# Altium schematic sheet usb.SchDoc
size 420 x 297 mm
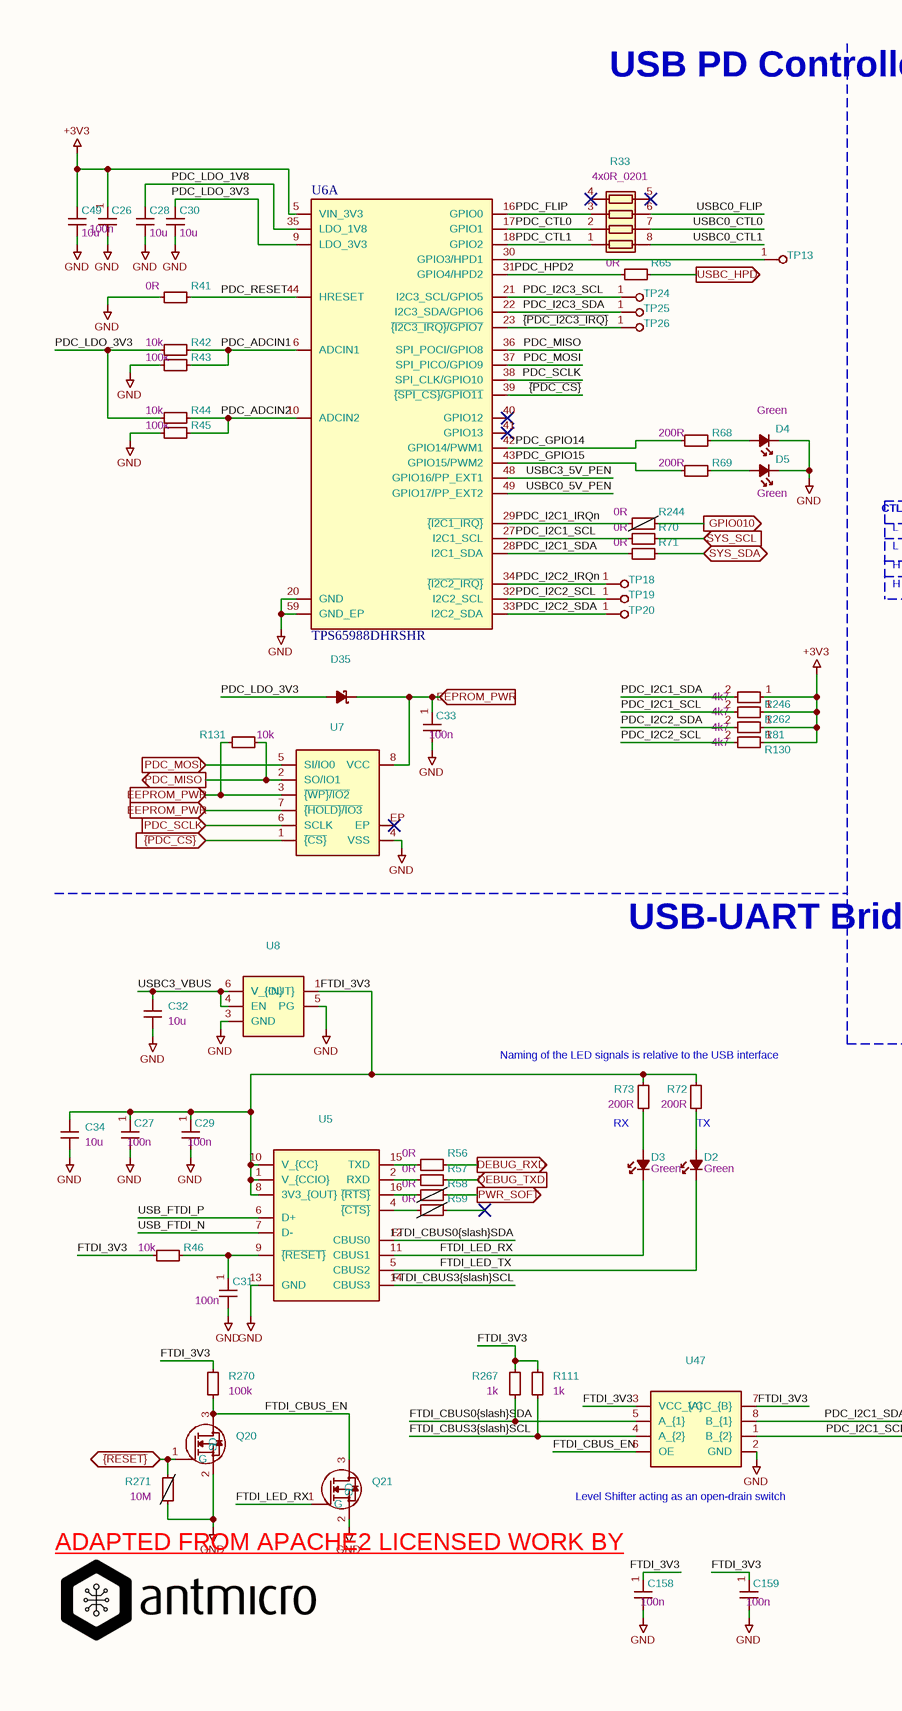
[diagram p0: usb.SchDoc, left]
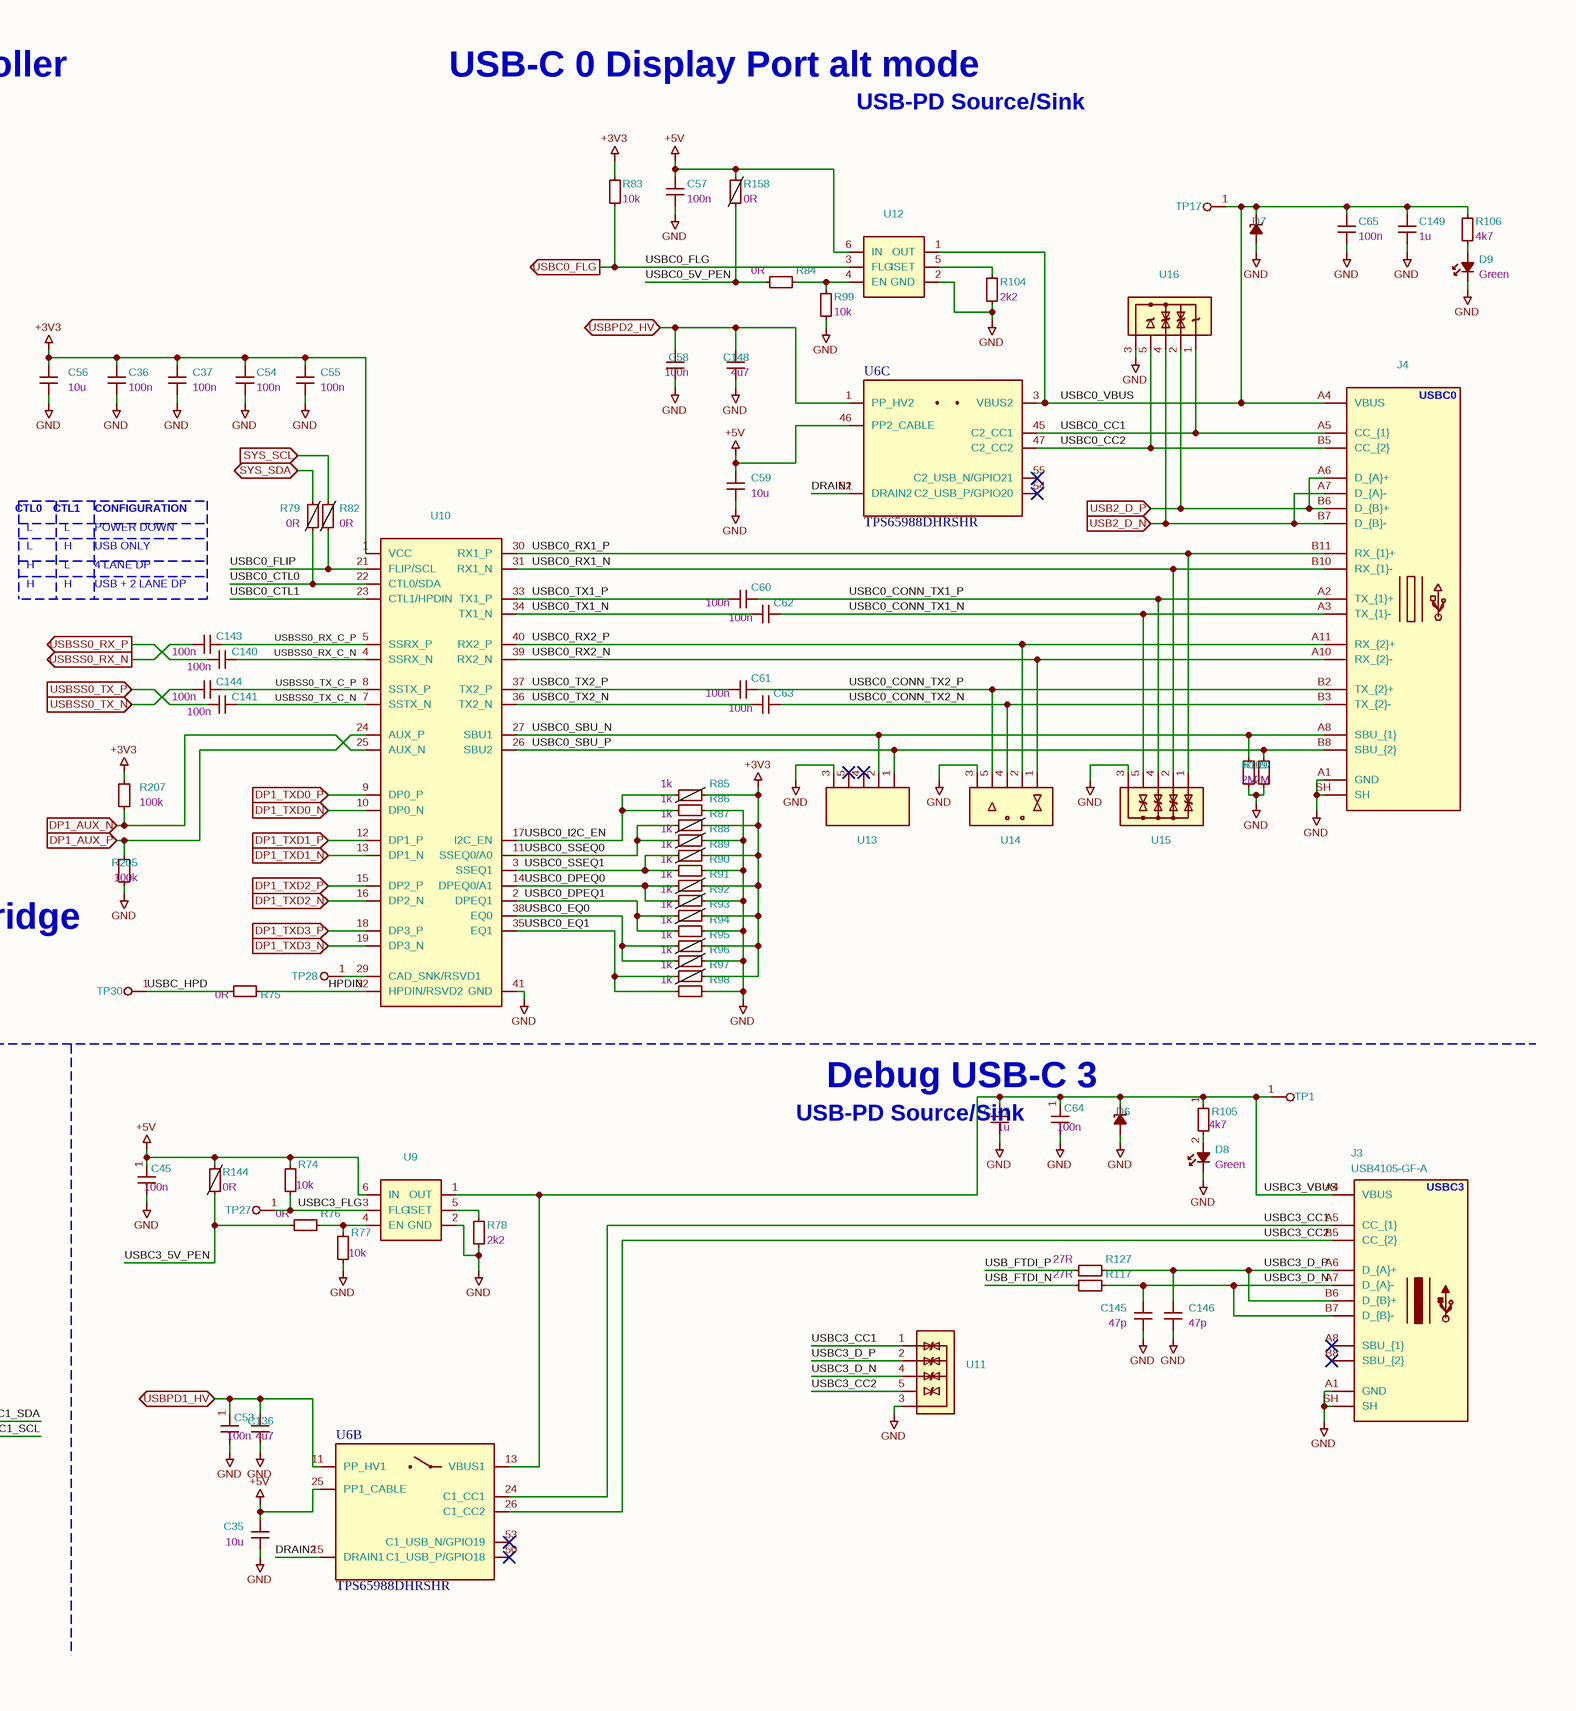
[diagram p1: usb.SchDoc, right]

## Parts
C26  Val: 100n  [C_0402_1005Metric]  (hidden comment: GRM155R61H104KE14D)
C27  Val: 100n  [C_0402_1005Metric]  (hidden comment: GRM155R61H104KE14D)
C28  Val: 10u  [C_0402_1005Metric]  (hidden comment: CC0402MRX5R5BB106)
C29  Val: 100n  [C_0402_1005Metric]  (hidden comment: GRM155R61H104KE14D)
C30  Val: 10u  [C_0402_1005Metric]  (hidden comment: CC0402MRX5R5BB106)
C31  Val: 100n  [C_0402_1005Metric]  (hidden comment: GRM155R61H104KE14D)
C32  Val: 10u  [C_0603_1608Metric]  (hidden comment: C1608X5R1E106M080AC)
C33  Val: 100n  [C_0402_1005Metric]  (hidden comment: GRM155R61H104KE14D)
C34  Val: 10u  [C_0402_1005Metric]  (hidden comment: CC0402MRX5R5BB106)
C35  Val: 10u  [C_0402_1005Metric]  (hidden comment: CC0402MRX5R5BB106)
C36  Val: 100n  [C_0402_1005Metric]  (hidden comment: GRM155R61H104KE14D)
C37  Val: 100n  [C_0402_1005Metric]  (hidden comment: GRM155R61H104KE14D)
C45  Val: 100n  [C_0402_1005Metric]  (hidden comment: GRM155R61H104KE14D)
C49  Val: 10u  [C_0402_1005Metric]  (hidden comment: CC0402MRX5R5BB106)
C53  Val: 100n  [C_0402_1005Metric]  (hidden comment: GRM155R61H104KE14D)
C54  Val: 100n  [C_0402_1005Metric]  (hidden comment: GRM155R61H104KE14D)
C55  Val: 100n  [C_0402_1005Metric]  (hidden comment: GRM155R61H104KE14D)
C56  Val: 10u  [C_0402_1005Metric]  (hidden comment: CC0402MRX5R5BB106)
C57  Val: 100n  [C_0402_1005Metric]  (hidden comment: GRM155R61H104KE14D)
C58  Val: 100n  [C_0402_1005Metric]  (hidden comment: GRM155R61H104KE14D)
C59  Val: 10u  [C_0402_1005Metric]  (hidden comment: CC0402MRX5R5BB106)
C60  Val: 100n  [C_0402_1005Metric]  (hidden comment: GRM155R61H104KE14D)
C61  Val: 100n  [C_0402_1005Metric]  (hidden comment: GRM155R61H104KE14D)
C62  Val: 100n  [C_0402_1005Metric]  (hidden comment: GRM155R61H104KE14D)
C63  Val: 100n  [C_0402_1005Metric]  (hidden comment: GRM155R61H104KE14D)
C64  Val: 100n  [C_0402_1005Metric]  (hidden comment: GRM155R61H104KE14D)
C65  Val: 100n  [C_0402_1005Metric]  (hidden comment: GRM155R61H104KE14D)
C136  Val: 4u7  [C_0402_1005Metric]  (hidden comment: GRM155C61E475ME15J)
C140  Val: 100n  [C_0402_1005Metric]  (hidden comment: GRM155R61H104KE14D)
C141  Val: 100n  [C_0402_1005Metric]  (hidden comment: GRM155R61H104KE14D)
C143  Val: 100n  [C_0402_1005Metric]  (hidden comment: GRM155R61H104KE14D)
C144  Val: 100n  [C_0402_1005Metric]  (hidden comment: GRM155R61H104KE14D)
C145  Val: 47p  [C_0402_1005Metric]  (hidden comment: C0402C470J5GACTU)
C146  Val: 47p  [C_0402_1005Metric]  (hidden comment: C0402C470J5GACTU)
C147  Val: 1u  [C_0402_1005Metric]  (hidden comment: GRM155R61E105KE11J)
C148  Val: 4u7  [C_0402_1005Metric]  (hidden comment: GRM155C61E475ME15J)
C149  Val: 1u  [C_0402_1005Metric]  (hidden comment: GRM155R61E105KE11J)
C158  Val: 100n  [C_0402_1005Metric]  (hidden comment: GRM155R61H104KE14D)
C159  Val: 100n  [C_0402_1005Metric]  (hidden comment: GRM155R61H104KE14D)
D2  Color: Green  [LED_0603_1608Metric_G]  (hidden comment: LTST-C190GKT)
D3  Color: Green  [LED_0603_1608Metric_G]  (hidden comment: LTST-C190GKT)
D4  Color: Green  [LED_0603_1608Metric_G]  (hidden comment: LTST-C190GKT)
D5  Color: Green  [LED_0603_1608Metric_G]  (hidden comment: LTST-C190GKT)
D6  DF2S30FS  [SOD-923]  (value not drawn)
D7  DF2S30FS  [SOD-923]  (value not drawn)
D8  Color: Green  [LED_0603_1608Metric_G]  (hidden comment: LTST-C190GKT)
D9  Color: Green  [LED_0603_1608Metric_G]  (hidden comment: LTST-C190GKT)
D35  RB521S30T1G  [SOD-523]  (value not drawn)
J3  USB4105-GF-A  [USB-C_Receptacle_GCT_USB4105-GF-A]
J4  632723300011  [USB-C_Receptacle_WE_632723300011]  (value not drawn)
Q20  PJE138K_R1_00001  [SOT-523]  (value not drawn)
Q21  PJE138K_R1_00001  [SOT-523]  (value not drawn)
R33  Val: 4x0R_0201  [R_Array_4x0201_Panasonic_EXB18V]  (hidden comment: EXB-18VR000X)
R41  Val: 0R  [R_0402_1005Metric]  (hidden comment: ERJ2GE0R00X)
R42  Val: 10k  [R_0402_1005Metric]  (hidden comment: CR0402-FX-1002GLF)
R43  Val: 100k  [R_0402_1005Metric]  (hidden comment: CR0402-FX-1003GLF)
R44  Val: 10k  [R_0402_1005Metric]  (hidden comment: CR0402-FX-1002GLF)
R45  Val: 100k  [R_0402_1005Metric]  (hidden comment: CR0402-FX-1003GLF)
R46  Val: 10k  [R_0402_1005Metric]  (hidden comment: CR0402-FX-1002GLF)
R56  Val: 0R  [R_0402_1005Metric]  (hidden comment: ERJ2GE0R00X)
R57  Val: 0R  [R_0402_1005Metric]  (hidden comment: ERJ2GE0R00X)
R58  Val: 0R  [R_0402_1005Metric]  (hidden comment: ERJ2GE0R00X)  (no BOM)
R59  Val: 0R  [R_0402_1005Metric]  (hidden comment: ERJ2GE0R00X)  (no BOM)
R65  Val: 0R  [R_0402_1005Metric]  (hidden comment: ERJ2GE0R00X)
R68  Val: 200R  [R_0402_1005Metric]  (hidden comment: CR0402-FX-2000GLF)
R69  Val: 200R  [R_0402_1005Metric]  (hidden comment: CR0402-FX-2000GLF)
R70  Val: 0R  [R_0402_1005Metric]  (hidden comment: ERJ2GE0R00X)
R71  Val: 0R  [R_0402_1005Metric]  (hidden comment: ERJ2GE0R00X)
R72  Val: 200R  [R_0402_1005Metric]  (hidden comment: CR0402-FX-2000GLF)
R73  Val: 200R  [R_0402_1005Metric]  (hidden comment: CR0402-FX-2000GLF)
R74  Val: 10k  [R_0402_1005Metric]  (hidden comment: CR0402-FX-1002GLF)
R75  Val: 0R  [R_0402_1005Metric]  (hidden comment: ERJ2GE0R00X)
R76  Val: 0R  [R_0402_1005Metric]  (hidden comment: ERJ2GE0R00X)
R77  Val: 10k  [R_0402_1005Metric]  (hidden comment: CR0402-FX-1002GLF)
R78  Val: 2k2  [R_0402_1005Metric]  (hidden comment: CR0402-FX-2201GLF)
R79  Val: 0R  [R_0402_1005Metric]  (hidden comment: ERJ2GE0R00X)  (no BOM)
R81  Val: 4k7  [R_0402_1005Metric]  (hidden comment: CR0402-FX-4701GLF)
R82  Val: 0R  [R_0402_1005Metric]  (hidden comment: ERJ2GE0R00X)  (no BOM)
R83  Val: 10k  [R_0402_1005Metric]  (hidden comment: CR0402-FX-1002GLF)
R84  Val: 0R  [R_0402_1005Metric]  (hidden comment: ERJ2GE0R00X)
R85  Val: 1k  [R_0402_1005Metric]  (hidden comment: CR0402-FX-1001GLF)  (no BOM)
R86  Val: 1k  [R_0402_1005Metric]  (hidden comment: CR0402-FX-1001GLF)
R87  Val: 1k  [R_0402_1005Metric]  (hidden comment: CR0402-FX-1001GLF)  (no BOM)
R88  Val: 1k  [R_0402_1005Metric]  (hidden comment: CR0402-FX-1001GLF)  (no BOM)
R89  Val: 1k  [R_0402_1005Metric]  (hidden comment: CR0402-FX-1001GLF)  (no BOM)
R90  Val: 1k  [R_0402_1005Metric]  (hidden comment: CR0402-FX-1001GLF)
R91  Val: 1k  [R_0402_1005Metric]  (hidden comment: CR0402-FX-1001GLF)  (no BOM)
R92  Val: 1k  [R_0402_1005Metric]  (hidden comment: CR0402-FX-1001GLF)  (no BOM)
R93  Val: 1k  [R_0402_1005Metric]  (hidden comment: CR0402-FX-1001GLF)  (no BOM)
R94  Val: 1k  [R_0402_1005Metric]  (hidden comment: CR0402-FX-1001GLF)
R95  Val: 1k  [R_0402_1005Metric]  (hidden comment: CR0402-FX-1001GLF)  (no BOM)
R96  Val: 1k  [R_0402_1005Metric]  (hidden comment: CR0402-FX-1001GLF)  (no BOM)
R97  Val: 1k  [R_0402_1005Metric]  (hidden comment: CR0402-FX-1001GLF)  (no BOM)
R98  Val: 1k  [R_0402_1005Metric]  (hidden comment: CR0402-FX-1001GLF)
R99  Val: 10k  [R_0402_1005Metric]  (hidden comment: CR0402-FX-1002GLF)
R104  Val: 2k2  [R_0402_1005Metric]  (hidden comment: CR0402-FX-2201GLF)
R105  Val: 4k7  [R_0402_1005Metric]  (hidden comment: CR0402-FX-4701GLF)
R106  Val: 4k7  [R_0402_1005Metric]  (hidden comment: CR0402-FX-4701GLF)
R109  Val: 2M  [R_0402_1005Metric]  (hidden comment: RC0402FR-072ML)
R110  Val: 2M  [R_0402_1005Metric]  (hidden comment: RC0402FR-072ML)
R111  Val: 1k  [R_0402_1005Metric]  (hidden comment: CR0402-FX-1001GLF)
R117  Val: 27R  [R_0402_1005Metric]  (hidden comment: CR0402-FX-27R0GLF)
R127  Val: 27R  [R_0402_1005Metric]  (hidden comment: CR0402-FX-27R0GLF)
R130  Val: 4k7  [R_0402_1005Metric]  (hidden comment: CR0402-FX-4701GLF)
R131  Val: 10k  [R_0402_1005Metric]  (hidden comment: CR0402-FX-1002GLF)
R144  Val: 0R  [R_0402_1005Metric]  (hidden comment: ERJ2GE0R00X)  (no BOM)
R158  Val: 0R  [R_0402_1005Metric]  (hidden comment: ERJ2GE0R00X)  (no BOM)
R205  Val: 100k  [R_0402_1005Metric]  (hidden comment: CR0402-FX-1003GLF)
R207  Val: 100k  [R_0402_1005Metric]  (hidden comment: CR0402-FX-1003GLF)
R244  Val: 0R  [R_0402_1005Metric]  (hidden comment: ERJ2GE0R00X)  (no BOM)
R246  Val: 4k7  [R_0402_1005Metric]  (hidden comment: CR0402-FX-4701GLF)
R262  Val: 4k7  [R_0402_1005Metric]  (hidden comment: CR0402-FX-4701GLF)
R267  Val: 1k  [R_0402_1005Metric]  (hidden comment: CR0402-FX-1001GLF)
R270  Val: 100k  [R_0402_1005Metric]  (hidden comment: CR0402-FX-1003GLF)
R271  Val: 10M  [R_0402_1005Metric]  (hidden comment: CR0402-FX-1005GLF)  (no BOM)
TP1  TP_0.75mm_SMD  [TP_SMD_0.75mm]  (value not drawn)  (no BOM)
TP13  TP_0.75mm_SMD  [TP_SMD_0.75mm]  (value not drawn)  (no BOM)
TP17  TP_0.75mm_SMD  [TP_SMD_0.75mm]  (value not drawn)  (no BOM)
TP18  TP_0.75mm_SMD  [TP_SMD_0.75mm]  (value not drawn)  (no BOM)
TP19  TP_0.75mm_SMD  [TP_SMD_0.75mm]  (value not drawn)  (no BOM)
TP20  TP_0.75mm_SMD  [TP_SMD_0.75mm]  (value not drawn)  (no BOM)
TP24  TP_0.75mm_SMD  [TP_SMD_0.75mm]  (value not drawn)  (no BOM)
TP25  TP_0.75mm_SMD  [TP_SMD_0.75mm]  (value not drawn)  (no BOM)
TP26  TP_0.75mm_SMD  [TP_SMD_0.75mm]  (value not drawn)  (no BOM)
TP27  TP_0.75mm_SMD  [TP_SMD_0.75mm]  (value not drawn)  (no BOM)
TP28  TP_0.75mm_SMD  [TP_SMD_0.75mm]  (value not drawn)  (no BOM)
TP30  TP_0.75mm_SMD  [TP_SMD_0.75mm]  (value not drawn)  (no BOM)
U5  FT230XQ-R  [QFN-16-1EP_4x4mm_P0.65mm]  (value not drawn)
U6  TPS65988DHRSHR  [IC_TPS65987DDHRSHR]  (parts A,B,C of 3)
U7  W25Q80DVUXIE TR  [USON-8_2x3mm_P0.5mm]  (value not drawn)
U8  NCP730BMT330TBG  [WSON-6-1EP_2x2mm_P0.65mm]  (value not drawn)
U9  AP22615AWU-7  [TSOT23-6]  (value not drawn)
U10  TUSB1046-DCIRNQT  [WQFN-40_1EP_6x3mm_Pitch0.4mm_EP4.7x2.7mm]  (value not drawn)
U11  TPD4E05U06QDQARQ1  [USON-10_2.5x1mm_P0.5mm]  (value not drawn)
U12  AP22615AWU-7  [TSOT23-6]  (value not drawn)
U13  TPD4E05U06QDQARQ1  [USON-10_2.5x1mm_P0.5mm]  (value not drawn)
U14  TPD4E05U06QDQARQ1  [USON-10_2.5x1mm_P0.5mm]  (value not drawn)
U15  TPD4E05U06QDQARQ1  [USON-10_2.5x1mm_P0.5mm]  (value not drawn)
U16  TPD4E05U06QDQARQ1  [USON-10_2.5x1mm_P0.5mm]  (value not drawn)
U47  NTS0102GT  [XSON-8_1x1.95mm_P0.5mm]  (value not drawn)

## Ports
DEBUG_RXD (out), DEBUG_TXD (in), DP1_AUX_N (in), DP1_AUX_P (in), DP1_TXD0_N (in), DP1_TXD0_P (in), DP1_TXD1_N (in), DP1_TXD1_P (in), DP1_TXD2_N (in), DP1_TXD2_P (in), DP1_TXD3_N (in), DP1_TXD3_P (in), EEPROM_PWR (in), GPIO010 (out), PDC_MISO (out), PDC_MOSI (in), PDC_SCLK (in), PWR_SOFT (out), SYS_SCL (in), SYS_SDA (bidir), USB2_D_N (in), USB2_D_P (in), USBC0_FLG (out), USBC_HPD (out), USBPD1_HV (bidir), USBPD2_HV (bidir), USBSS0_RX_N (out), USBSS0_RX_P (out), USBSS0_TX_N (in), USBSS0_TX_P (in), ~{{PDC_CS}} (in), ~{{RESET}} (bidir)

## Nets
+3V3: C26.1 C36.1 C37.1 C49.2 C54.1 C55.1 C56.2 R81.1 R83.2 R85.2 R87.2 R89.2 R91.2 R93.2 R95.2 R97.2 R130.1 R207.2 R246.1 R262.1 U6.5(VIN_3V3) U10.1(VCC)
+5V: C35.2 C45.1 C57.1 C59.1 R74.2 R144.2 R158.2 U6.25(PP1_CABLE) U6.46(PP2_CABLE) U9.6(IN) U12.6(IN)
GND: C26.2 C27.2 C28.1 C29.2 C30.1 C31.2 C32.2 C33.2 C34.1 C35.1 C36.2 C37.2 C45.2 C49.1 C53.2 C54.2 C55.2 C56.1 C57.2 C58.2 C59.2 C64.2 C65.2 C136.2 C145.1 C146.2 C147.2 C148.2 C149.1 C158.2 C159.2 D4.1(C) D5.1(C) D6.2(A) D7.2(A) D8.1(C) D9.1(C) J3.A1(GND) J3.SH J4.A1(GND) J4.SH Q20.2(S) Q21.2(S) R41.1 R43.1 R45.1 R77.1 R78.1 R86.2 R88.2 R90.2 R92.2 R94.2 R96.2 R98.2 R99.1 R104.1 R109.2 R110.2 R205.2 R271.1 U5.13(GND) U6.20(GND) U6.59(GND_EP) U7.4(VSS) U8.3(GND) U8.5(PG) U9.2(GND) U10.41(GND) U11.3 U12.2(GND) U13.3 U14.3 U15.3 U16.3 U47.2(GND)
DEBUG_RXD: R56.2 ; port DEBUG_RXD
DEBUG_TXD: R57.2 ; port DEBUG_TXD
DP1_AUX_N: R207.1 U10.25(AUX_N) ; port DP1_AUX_N
DP1_AUX_P: R205.1 U10.24(AUX_P) ; port DP1_AUX_P
DP1_TXD0_N: U10.10(DP0_N) ; port DP1_TXD0_N
DP1_TXD0_P: U10.9(DP0_P) ; port DP1_TXD0_P
DP1_TXD1_N: U10.13(DP1_N) ; port DP1_TXD1_N
DP1_TXD1_P: U10.12(DP1_P) ; port DP1_TXD1_P
DP1_TXD2_N: U10.16(DP2_N) ; port DP1_TXD2_N
DP1_TXD2_P: U10.15(DP2_P) ; port DP1_TXD2_P
DP1_TXD3_N: U10.19(DP3_N) ; port DP1_TXD3_N
DP1_TXD3_P: U10.18(DP3_P) ; port DP1_TXD3_P
DRAIN1: U6.52(DRAIN2)
DRAIN2: U6.15(DRAIN1)
EEPROM_PWR: C33.1 D35.1(C) R131.2 U7.3(~{{WP}/IO2}) U7.7(~{{HOLD}/IO3}) U7.8(VCC) ; port EEPROM_PWR
FTDI_3V3: C27.1 C29.1 C34.2 C158.1 C159.1 R46.1 R72.2 R73.2 R111.2 R267.2 R270.2 U5.1(V_{CCIO}) U5.8(3V3_{OUT}) U5.10(V_{CC}) U8.1(V_{OUT}) U47.3(VCC_{A}) U47.7(VCC_{B})
FTDI_CBUS0{slash}SDA: R267.1 U5.12(CBUS0) U47.5(A_{1})
FTDI_CBUS3{slash}SCL: R111.1 U5.14(CBUS3) U47.4(A_{2})
FTDI_CBUS_EN: Q20.3(D) Q21.3(D) R270.1 U47.6(OE)
FTDI_LED_RX: D3.1(C) Q21.1(G) U5.11(CBUS1)
FTDI_LED_TX: D2.1(C) U5.5(CBUS2)
GPIO010: R244.2 ; port GPIO010
HPDIN: R75.2 U10.32(HPDIN/RSVD2)
PDC_ADCIN1: R42.2 R43.2 U6.6(ADCIN1)
PDC_ADCIN2: R44.2 R45.2 U6.10(ADCIN2)
PDC_CTL0: R33.2(R2.1) U6.17(GPIO1)
PDC_CTL1: R33.1(R1.1) U6.18(GPIO2)
PDC_FLIP: R33.3(R3.1) U6.16(GPIO0)
PDC_GPIO14: R68.1 U6.42(GPIO14/PWM1)
PDC_GPIO15: R69.1 U6.43(GPIO15/PWM2)
PDC_HPD2: R65.1 U6.31(GPIO4/HPD2)
PDC_I2C1_IRQn: R244.1 U6.29(~{{I2C1_IRQ}})
PDC_I2C1_SCL: R70.1 R262.2 U6.27(I2C1_SCL) U47.1(B_{2})
PDC_I2C1_SDA: R71.1 R246.2 U6.28(I2C1_SDA) U47.8(B_{1})
PDC_I2C2_IRQn: TP18.1 U6.34(~{{I2C2_IRQ}})
PDC_I2C2_SCL: R130.2 TP19.1 U6.32(I2C2_SCL)
PDC_I2C2_SDA: R81.2 TP20.1 U6.33(I2C2_SDA)
PDC_I2C3_SCL: TP24.1 U6.21(I2C3_SCL/GPIO5)
PDC_I2C3_SDA: TP25.1 U6.22(I2C3_SDA/GPIO6)
PDC_LDO_1V8: C28.2 U6.35(LDO_1V8)
PDC_LDO_3V3: C30.2 D35.2(A) R42.1 R44.1 U6.9(LDO_3V3)
PDC_MISO: U6.36(SPI_POCI/GPIO8)
PDC_MISO: R131.1 U7.2(SO/IO1) ; port PDC_MISO  [a separate net that carries the same name]
PDC_MOSI: U6.37(SPI_PICO/GPIO9)
PDC_MOSI: U7.5(SI/IO0) ; port PDC_MOSI  [a separate net that carries the same name]
PDC_RESET: R41.2 U6.44(HRESET)
PDC_SCLK: U6.38(SPI_CLK/GPIO10)
PDC_SCLK: U7.6(SCLK) ; port PDC_SCLK  [a separate net that carries the same name]
PWR_SOFT: R58.2 ; port PWR_SOFT
SYS_SCL: R70.2 R82.2 ; port SYS_SCL
SYS_SDA: R71.2 R79.2 ; port SYS_SDA
USB2_D_N: J4.A7(D_{A}-) J4.B7(D_{B}-) U16.4 ; port USB2_D_N
USB2_D_P: J4.A6(D_{A}+) J4.B6(D_{B}+) U16.2 ; port USB2_D_P
USB_FTDI_N: R117.1 U5.7(D-)
USB_FTDI_P: R127.1 U5.6(D+)
USBC0_5V_PEN: R84.1 R158.1 U6.49(GPIO17/PP_EXT2)
USBC0_CC1: J4.A5(CC_{1}) U6.45(C2_CC1) U16.1
USBC0_CC2: J4.B5(CC_{2}) U6.47(C2_CC2) U16.5
USBC0_CONN_TX1_N: C62.2 J4.A3(TX_{1}-) U15.5
USBC0_CONN_TX1_P: C60.2 J4.A2(TX_{1}+) U15.4
USBC0_CONN_TX2_N: C63.2 J4.B3(TX_{2}-) U14.4
USBC0_CONN_TX2_P: C61.2 J4.B2(TX_{2}+) U14.5
USBC0_CTL0: R33.7(R2.2) R79.1 U10.22(CTL0/SDA)
USBC0_CTL1: R33.8(R1.2) U10.23(CTL1/HPDIN)
USBC0_DPEQ0: R91.1 R92.1 U10.14(DPEQ0/A1)
USBC0_DPEQ1: R93.1 R94.1 U10.2(DPEQ1)
USBC0_EQ0: R95.1 R96.1 U10.38(EQ0)
USBC0_EQ1: R97.1 R98.1 U10.35(EQ1)
USBC0_FLG: R83.1 U12.3(FLG) ; port USBC0_FLG
USBC0_FLIP: R33.6(R3.2) R82.1 U10.21(FLIP/SCL)
USBC0_I2C_EN: R85.1 R86.1 U10.17(I2C_EN)
USBC0_RX1_N: J4.B10(RX_{1}-) U10.31(RX1_N) U15.2
USBC0_RX1_P: J4.B11(RX_{1}+) U10.30(RX1_P) U15.1
USBC0_RX2_N: J4.A10(RX_{2}-) U10.39(RX2_N) U14.1
USBC0_RX2_P: J4.A11(RX_{2}+) U10.40(RX2_P) U14.2
USBC0_SBU_N: J4.A8(SBU_{1}) R109.1 U10.27(SBU1) U13.2
USBC0_SBU_P: J4.B8(SBU_{2}) R110.1 U10.26(SBU2) U13.1
USBC0_SSEQ0: R87.1 R88.1 U10.11(SSEQ0/A0)
USBC0_SSEQ1: R89.1 R90.1 U10.3(SSEQ1)
USBC0_TX1_N: C62.1 U10.34(TX1_N)
USBC0_TX1_P: C60.1 U10.33(TX1_P)
USBC0_TX2_N: C63.1 U10.36(TX2_N)
USBC0_TX2_P: C61.1 U10.37(TX2_P)
USBC0_VBUS: C65.1 C149.2 D7.1(C) J4.A4(VBUS) R106.2 TP17.1 U6.3(VBUS2) U12.1(OUT)
USBC3_5V_PEN: R76.1 R144.1 U6.48(GPIO16/PP_EXT1)
USBC3_CC1: J3.A5(CC_{1}) U6.24(C1_CC1) U11.1
USBC3_CC2: J3.B5(CC_{2}) U6.26(C1_CC2) U11.5
USBC3_D_N: C145.2 J3.A7(D_{A}-) J3.B7(D_{B}-) R117.2 U11.4
USBC3_D_P: C146.1 J3.A6(D_{A}+) J3.B6(D_{B}+) R127.2 U11.2
USBC3_FLG: R74.1 TP27.1 U9.3(FLG)
USBC3_VBUS: C32.1 C64.1 C147.1 D6.1(C) J3.A4(VBUS) R105.1 TP1.1 U6.13(VBUS1) U8.4(EN) U8.6(V_{IN}) U9.1(OUT)
USBC_HPD: R75.1 TP30.1
USBC_HPD: R65.2 ; port USBC_HPD  [a separate net that carries the same name]
USBPD1_HV: C53.1 C136.1 U6.11(PP_HV1) ; port USBPD1_HV
USBPD2_HV: C58.1 C148.1 U6.1(PP_HV2) ; port USBPD2_HV
USBSS0_RX_C_N: C140.2 U10.4(SSRX_N)
USBSS0_RX_C_P: C143.2 U10.5(SSRX_P)
USBSS0_RX_N: C143.1 ; port USBSS0_RX_N
USBSS0_RX_P: C140.1 ; port USBSS0_RX_P
USBSS0_TX_C_N: C141.2 U10.7(SSTX_N)
USBSS0_TX_C_P: C144.2 U10.8(SSTX_P)
USBSS0_TX_N: C144.1 ; port USBSS0_TX_N
USBSS0_TX_P: C141.1 ; port USBSS0_TX_P
~{{PDC_CS}}: U6.39(~{{SPI_CS}/GPIO11})
~{{PDC_CS}}: U7.1(~{{CS}}) ; port ~{{PDC_CS}}  [a separate net that carries the same name]
~{{PDC_I2C3_IRQ}}: TP26.1 U6.23(~{{I2C3_IRQ}/GPIO7})
~{{RESET}}: Q20.1(G) R271.2 ; port ~{{RESET}}
NetC31_1: C31.1 R46.2 U5.9(~{{RESET}})
NetD2_2: D2.2(A) R72.1
NetD3_2: D3.2(A) R73.1
NetD4_2: D4.2(A) R68.2
NetD5_2: D5.2(A) R69.2
NetD8_2: D8.2(A) R105.2
NetD9_2: D9.2(A) R106.1
NetR56_1: R56.1 U5.15(TXD)
NetR57_1: R57.1 U5.2(RXD)
NetR58_1: R58.1 U5.16(~{{RTS}})
NetR59_1: R59.1 U5.4(~{{CTS}})
NetR76_2: R76.2 R77.2 U9.4(EN)
NetR78_2: R78.2 U9.5(ISET)
NetR84_2: R84.2 R99.2 U12.4(EN)
NetR104_2: R104.2 U12.5(ISET)
NetTP13_1: TP13.1 U6.30(GPIO3/HPD1)
NetTP28_1: TP28.1 U10.29(CAD_SNK/RSVD1)

Not connected (* = marked no-connect by the designer): J3 A8(SBU_{1})* A9(VBUS) A12(GND) B1(GND) B4(VBUS) B8(SBU_{2})* B9(VBUS) B12(GND); J4 A9(VBUS) A12(GND) B1(GND) B4(VBUS) B9(VBUS) B12(GND); R33 4(R4.1)* 5(R4.2)*; R59 2*; U5 3(GND) 17(GND); U6 7(DRAIN2) 8(DRAIN1) 19(DRAIN1) 40(GPIO12)* 41(GPIO13)* 50(C1_USB_P/GPIO18)* 51(GND) 53(C1_USB_N/GPIO19)* 54(C2_USB_P/GPIO20)* 55(C2_USB_N/GPIO21)* 56(DRAIN2) 57(DRAIN2) 58(DRAIN1); U7 EP*; U8 2(NC) 7(GND); U10 6(VCC) 20(VCC) 28(VCC); U11 6 7 8 9 10; U13 4* 5* 6 7 8 9 10; U14 6 7 8 9 10; U15 6 7 8 9 10; U16 6 7 8 9 10

## Notes on the sheet
- USB PD Controller
- USB-C 0 Display Port alt mode
- USB-PD Source/Sink
- USBC0
- CTL0
- L
- CTL1
- H
- POWER DOWN
- CONFIGURATION
- USB ONLY
- 4 LANE DP
- USB + 2 LANE DP
- USB-UART Bridge
- Naming of the LED signals is relative to the USB interface
- RX
- (near R72) TX
- (near C147) USB-PD Source/Sink
- Debug USB-C 3
- USBC3
- (near U47) Level Shifter acting as an open-drain switch
- ADAPTED FROM APACHE2 LICENSED WORK BY <https://github.com/antmicro/jetson-orin-baseboard>
- 1
- 2
- 3
- 4
- 5
- 6
- 7
- 8
- A
- B
- C
- D
- E
- www.antmicro.com <http://www.antmicro.com>
- Title: Jetson Orin Baseboard
- File: usb.kicad_sch
- Sheet: /
- Antmicro Ltd
- F
- KiCad E.D.A.  kicad (5.1.4)-1
- Size: A3
- Date: 2025-01-15
- Rev: 1.3.0
- Id: 1/1

## Library data of the parts
C26 C27 C29 C31 C33 C36 C37 C45 C53-C55 C57 C58 C60-C65 C140 C141 C143 C144 C158 C159 = C_100n_0402: Manufacturer 1: Murata; License: Apache-2.0; Voltage: 50V; Dielectric: X5R; Author: Antmicro; OldValue: C_100n_0402; Manufacturer Part Number 1: GRM155R61H104KE14D; Value: GRM155R61H104KE14D; Footprint: antmicro-footprints:C_0402_1005Metric
C28 C30 C34 C35 C49 C56 C59 = C_10u_0402: Manufacturer 1: YAGEO; License: Apache-2.0; Author: Antmicro; OldValue: C_10u_0402; Manufacturer Part Number 1: CC0402MRX5R5BB106; Value: CC0402MRX5R5BB106; Footprint: antmicro-footprints:C_0402_1005Metric
C32 = C_10u_25V_0603: Manufacturer 1: TDK; License: Apache-2.0; Voltage: 25V; Author: Antmicro; OldValue: C_10u_25V_0603; Manufacturer Part Number 1: C1608X5R1E106M080AC; Value: C1608X5R1E106M080AC; Footprint: antmicro-footprints:C_0603_1608Metric
C136 C148 = C_4u7_25V_0402: Manufacturer 1: Murata; License: Apache-2.0; Voltage: 25V; Dielectric: X5S; Author: Antmicro; OldValue: C_4u7_25V_0402; Manufacturer Part Number 1: GRM155C61E475ME15J; Value: GRM155C61E475ME15J; Footprint: antmicro-footprints:C_0402_1005Metric
C145 C146 = C_47p_0402: Manufacturer 1: KEMET; License: Apache-2.0; Dielectric: C0G; Author: Antmicro; OldValue: C_47p_0402; Manufacturer Part Number 1: C0402C470J5GACTU; Value: C0402C470J5GACTU; Footprint: antmicro-footprints:C_0402_1005Metric
C147 C149 = C_1u_25V_0402: Manufacturer 1: Murata; License: Apache-2.0; Voltage: 25V; Dielectric: X5R; Author: Antmicro; OldValue: C_1u_25V_0402; Manufacturer Part Number 1: GRM155R61E105KE11J; Value: GRM155R61E105KE11J; Footprint: antmicro-footprints:C_0402_1005Metric
D2-D5 D8 D9 = LED_G_0603_LTST-C190GKT: Manufacturer 1: Lite-On; License: Apache-2.0; Author: Antmicro; OldValue: LED_G_0603_LTST-C190GKT; Manufacturer Part Number 1: LTST-C190GKT; Value: LTST-C190GKT; Footprint: antmicro-footprints:LED_0603_1608Metric_G
D6 D7 = DF2S30FS_SOD: Manufacturer 1: Toshiba; License: Apache-2.0; Author: Antmicro; OldValue: DF2S30FS_SOD; Manufacturer Part Number 1: DF2S30FS; Value: DF2S30FS; Footprint: antmicro-footprints:SOD-923
D35 = RB521S30T1G: Manufacturer 1: ON Semiconductor; License: Apache-2.0; Author: Antmicro; OldValue: RB521S30T1G; Manufacturer Part Number 1: RB521S30T1G; Value: RB521S30T1G; Footprint: antmicro-footprints:SOD-523
J3 = USB-C_GCT_USB4105-GF-A: Manufacturer 1: GCT; License: Apache-2.0; Author: Antmicro; OldValue: USB-C_GCT_USB4105-GF-A; Manufacturer Part Number 1: USB4105-GF-A; Value: USB4105-GF-A; Footprint: antmicro-footprints:USB-C_Receptacle_GCT_USB4105-GF-A
J4 = USB-C_WE_632723300011: Manufacturer 1: Würth Elektronik; License: Apache-2.0; Author: Antmicro; OldValue: USB-C_WE_632723300011; Manufacturer Part Number 1: 632723300011; Value: 632723300011; Footprint: antmicro-footprints:USB-C_Receptacle_WE_632723300011
Q20 Q21 = PJE138K: Manufacturer 1: PANJIT; License: Apache-2.0; Author: Antmicro; OldValue: PJE138K; Manufacturer Part Number 1: PJE138K_R1_00001; Value: PJE138K_R1_00001; Footprint: antmicro-footprints:SOT-523
R33 = R_4x0R_0201_array: Manufacturer 1: Panasonic; License: Apache-2.0; Author: Antmicro; OldValue: R_4x0R_0201_array; Manufacturer Part Number 1: EXB-18VR000X; Value: EXB-18VR000X; Footprint: antmicro-footprints:R_Array_4x0201_Panasonic_EXB18V
R41 R56-R59 R65 R70 R71 R75 R76 R79 R82 R84 R158 R244 = R_0R_0402: Manufacturer 1: Panasonic; License: Apache-2.0; Tolerance: ~; Current: 1A; Author: Antmicro; OldValue: R_0R_0402; Manufacturer Part Number 1: ERJ2GE0R00X; Value: ERJ2GE0R00X; Footprint: antmicro-footprints:R_0402_1005Metric
R42 R44 R46 R74 R77 R83 R99 R131 = R_10k_0402: Manufacturer 1: Bourns; License: Apache-2.0; Tolerance: 1%; Author: Antmicro; OldValue: R_10k_0402; Manufacturer Part Number 1: CR0402-FX-1002GLF; Value: CR0402-FX-1002GLF; Footprint: antmicro-footprints:R_0402_1005Metric
R43 R45 R205 R207 R270 = R_100k_0402: Manufacturer 1: Bourns; License: Apache-2.0; Tolerance: 1%; Author: Antmicro; OldValue: R_100k_0402; Manufacturer Part Number 1: CR0402-FX-1003GLF; Value: CR0402-FX-1003GLF; Footprint: antmicro-footprints:R_0402_1005Metric
R68 R69 R72 R73 = R_200R_0402: Manufacturer 1: Bourns; License: Apache-2.0; Tolerance: 1%; Author: Antmicro; OldValue: R_200R_0402; Manufacturer Part Number 1: CR0402-FX-2000GLF; Value: CR0402-FX-2000GLF; Footprint: antmicro-footprints:R_0402_1005Metric
R78 R104 = R_2k2_0402: Manufacturer 1: Bourns; License: Apache-2.0; Tolerance: 1%; Author: Antmicro; OldValue: R_2k2_0402; Manufacturer Part Number 1: CR0402-FX-2201GLF; Value: CR0402-FX-2201GLF; Footprint: antmicro-footprints:R_0402_1005Metric
R81 R105 R106 R130 R246 R262 = R_4k7_0402: Manufacturer 1: Bourns; License: Apache-2.0; Tolerance: 1%; Author: Antmicro; OldValue: R_4k7_0402; Manufacturer Part Number 1: CR0402-FX-4701GLF; Value: CR0402-FX-4701GLF; Footprint: antmicro-footprints:R_0402_1005Metric
R85-R98 R111 R267 = R_1k_0402: Manufacturer 1: Bourns; License: Apache-2.0; Tolerance: 1%; Author: Antmicro; OldValue: R_1k_0402; Manufacturer Part Number 1: CR0402-FX-1001GLF; Value: CR0402-FX-1001GLF; Footprint: antmicro-footprints:R_0402_1005Metric
R109 R110 = R_2M_0402: Manufacturer 1: YAGEO; License: Apache-2.0; Tolerance: 1%; Author: Antmicro; OldValue: R_2M_0402; Manufacturer Part Number 1: RC0402FR-072ML; Value: RC0402FR-072ML; Footprint: antmicro-footprints:R_0402_1005Metric
R117 R127 = R_27R_0402: Manufacturer 1: Bourns; License: Apache-2.0; Tolerance: 1%; Author: Antmicro; OldValue: R_27R_0402; Manufacturer Part Number 1: CR0402-FX-27R0GLF; Value: CR0402-FX-27R0GLF; Footprint: antmicro-footprints:R_0402_1005Metric
R144 = R_0R_0402_11: Manufacturer 1: Panasonic; License: Apache-2.0; Tolerance: ~; Current: 1A; Author: Antmicro; OldValue: R_0R_0402; Manufacturer Part Number 1: ERJ2GE0R00X; Value: ERJ2GE0R00X; Footprint: antmicro-footprints:R_0402_1005Metric
R271 = R_10M_0402: Manufacturer 1: Bourns; License: Apache-2.0; Tolerance: 1%; Author: Antmicro; OldValue: R_10M_0402; Manufacturer Part Number 1: CR0402-FX-1005GLF; Value: CR0402-FX-1005GLF; Footprint: antmicro-footprints:R_0402_1005Metric
TP1 TP17 TP28 = TP_0.75mm_SMD: License: Apache-2.0; Author: Antmicro; OldValue: TP_0.75mm_SMD; Value: TP_0.75mm_SMD; Footprint: antmicro-footprints:TP_SMD_0.75mm
TP13 = TP_0.75mm_SMD_4: License: Apache-2.0; Author: Antmicro; OldValue: TP_0.75mm_SMD; Value: TP_0.75mm_SMD; Footprint: antmicro-footprints:TP_SMD_0.75mm
TP18 = TP_0.75mm_SMD_2: License: Apache-2.0; Author: Antmicro; OldValue: TP_0.75mm_SMD; Value: TP_0.75mm_SMD; Footprint: antmicro-footprints:TP_SMD_0.75mm
TP19 = TP_0.75mm_SMD_7: License: Apache-2.0; Author: Antmicro; OldValue: TP_0.75mm_SMD; Value: TP_0.75mm_SMD; Footprint: antmicro-footprints:TP_SMD_0.75mm
TP20 = TP_0.75mm_SMD_6: License: Apache-2.0; Author: Antmicro; OldValue: TP_0.75mm_SMD; Value: TP_0.75mm_SMD; Footprint: antmicro-footprints:TP_SMD_0.75mm
TP24 TP30 = TP_0.75mm_SMD_3: License: Apache-2.0; Author: Antmicro; OldValue: TP_0.75mm_SMD; Value: TP_0.75mm_SMD; Footprint: antmicro-footprints:TP_SMD_0.75mm
TP25 = TP_0.75mm_SMD_1: License: Apache-2.0; Author: Antmicro; OldValue: TP_0.75mm_SMD; Value: TP_0.75mm_SMD; Footprint: antmicro-footprints:TP_SMD_0.75mm
TP26 = TP_0.75mm_SMD_5: License: Apache-2.0; Author: Antmicro; OldValue: TP_0.75mm_SMD; Value: TP_0.75mm_SMD; Footprint: antmicro-footprints:TP_SMD_0.75mm
TP27 = TP_0.75mm_SMD_10: License: Apache-2.0; Author: Antmicro; OldValue: TP_0.75mm_SMD; Value: TP_0.75mm_SMD; Footprint: antmicro-footprints:TP_SMD_0.75mm
U5 = FT230X_QFN: Manufacturer 1: FTDI Chip; License: Apache-2.0; Author: Antmicro; OldValue: FT230X_QFN; Manufacturer Part Number 1: FT230XQ-R; Value: FT230XQ-R; Footprint: antmicro-footprints:QFN-16-1EP_4x4mm_P0.65mm
U7 = W25Q80DV_USON: Manufacturer 1: Winbond; License: Apache-2.0; Author: Antmicro; OldValue: W25Q80DV_USON; Manufacturer Part Number 1: W25Q80DVUXIE TR; Value: W25Q80DVUXIE TR; Footprint: antmicro-footprints:USON-8_2x3mm_P0.5mm
U8 = NCP730BMT330_WSON: Manufacturer 1: ON Semiconductor; License: Apache-2.0; Author: Antmicro; OldValue: NCP730BMT330_WSON; Manufacturer Part Number 1: NCP730BMT330TBG; Value: NCP730BMT330TBG; Footprint: antmicro-footprints:WSON-6-1EP_2x2mm_P0.65mm
U9 U12 = AP22615A_TSOT26: Manufacturer 1: Diodes Incorporated; License: Apache-2.0; Author: Antmicro; OldValue: AP22615A_TSOT26; Manufacturer Part Number 1: AP22615AWU-7; Value: AP22615AWU-7; Footprint: antmicro-footprints:TSOT23-6
U10 = TUSB1046-DCIRNQ: Manufacturer 1: Texas Instruments; License: Apache-2.0; Author: Antmicro; OldValue: TUSB1046-DCIRNQ; Manufacturer Part Number 1: TUSB1046-DCIRNQT; Value: TUSB1046-DCIRNQT; Footprint: antmicro-footprints:WQFN-40_1EP_6x3mm_Pitch0.4mm_EP4.7x2.7mm
U11 = TPD4E05U06QDQARQ1_1: Manufacturer 1: Texas Instruments; License: Apache-2.0; Author: Antmicro; OldValue: TPD4E05U06QDQARQ1; Manufacturer Part Number 1: TPD4E05U06QDQARQ1; Value: TPD4E05U06QDQARQ1; Footprint: antmicro-footprints:USON-10_2.5x1mm_P0.5mm
U13-U16 = TPD4E05U06QDQARQ1: Manufacturer 1: Texas Instruments; License: Apache-2.0; Author: Antmicro; OldValue: TPD4E05U06QDQARQ1; Manufacturer Part Number 1: TPD4E05U06QDQARQ1; Value: TPD4E05U06QDQARQ1; Footprint: antmicro-footprints:USON-10_2.5x1mm_P0.5mm
U47 = NTS0102_XSON: Manufacturer 1: NXP; License: Apache-2.0; Author: Antmicro; OldValue: NTS0102_XSON; Manufacturer Part Number 1: NTS0102GT; Value: NTS0102GT; Footprint: antmicro-footprints:XSON-8_1x1.95mm_P0.5mm